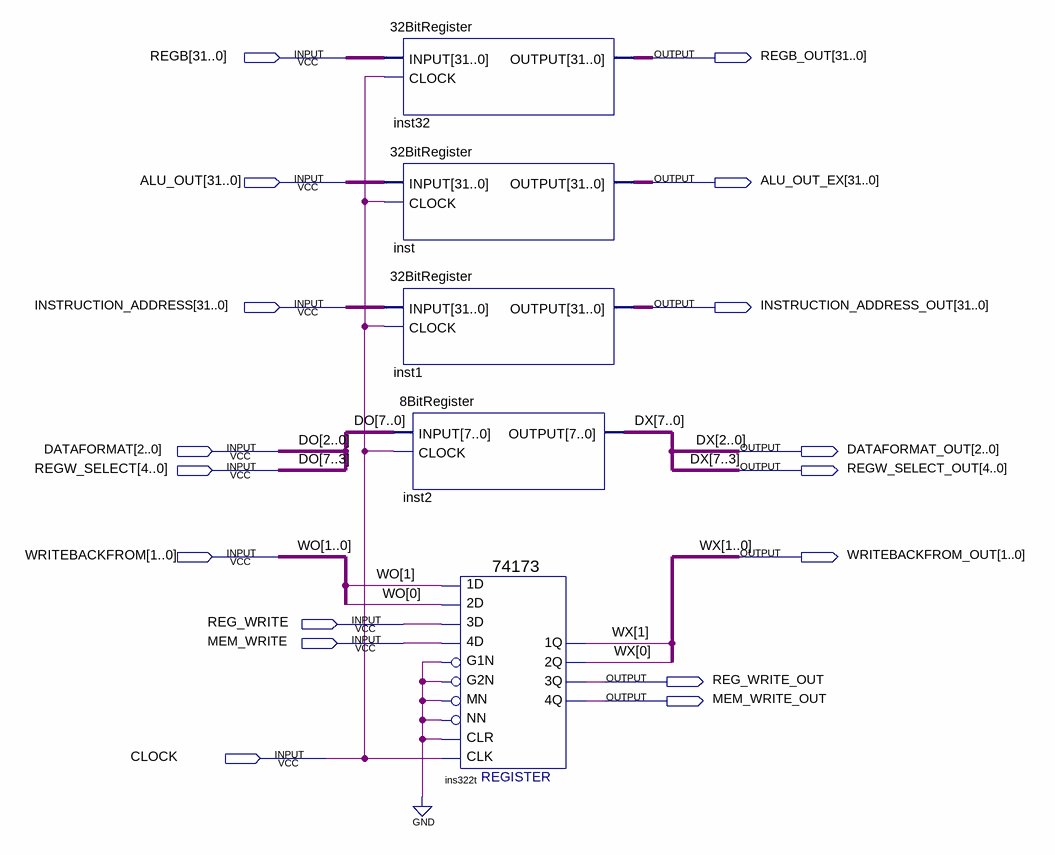
[diagram p0: schematic sheet]
// Quartus schematic EXECUTE_MEMACCESS.bdf as structural Verilog: 5 symbols, 17 pins
module EXECUTE_MEMACCESS (
  input  [31:0] REGB,
  input  [31:0] ALU_OUT,
  input  [31:0] INSTRUCTION_ADDRESS,
  input  [2:0] DATAFORMAT,
  input  [4:0] REGW_SELECT,
  input  [1:0] WRITEBACKFROM,
  input  REG_WRITE,
  input  MEM_WRITE,
  input  CLOCK,
  output [31:0] REGB_OUT,
  output [31:0] ALU_OUT_EX,
  output [31:0] INSTRUCTION_ADDRESS_OUT,
  output [2:0] DATAFORMAT_OUT,
  output [4:0] REGW_SELECT_OUT,
  output [1:0] WRITEBACKFROM_OUT,
  output REG_WRITE_OUT,
  output MEM_WRITE_OUT
);

  \32BitRegister  inst32 (.INPUT(REGB), .CLOCK(CLOCK), .OUTPUT(REGB_OUT));
  \32BitRegister  inst (.INPUT(ALU_OUT), .CLOCK(CLOCK), .OUTPUT(ALU_OUT_EX));
  \32BitRegister  inst1 (.INPUT(INSTRUCTION_ADDRESS), .CLOCK(CLOCK), .OUTPUT(INSTRUCTION_ADDRESS_OUT));
  \8BitRegister  inst2 (.INPUT({REGW_SELECT, DATAFORMAT}), .CLOCK(CLOCK), .OUTPUT({REGW_SELECT_OUT, DATAFORMAT_OUT}));
  \74173  ins322t (
    .\3D (REG_WRITE), .MN(1'b0), .\1D (WRITEBACKFROM[1]), .\2D (WRITEBACKFROM[0]), .\4D (MEM_WRITE),
    .G1N(1'b0), .G2N(1'b0), .NN(1'b0), .CLR(1'b0), .CLK(CLOCK), .\3Q (REG_WRITE_OUT),
    .\2Q (WRITEBACKFROM_OUT[0]), .\1Q (WRITEBACKFROM_OUT[1]), .\4Q (MEM_WRITE_OUT));

  // Other names for the same wires on the sheet: DO[7:0] = {REGW_SELECT, DATAFORMAT};
  //   DX[7:0] = {REGW_SELECT_OUT, DATAFORMAT_OUT}; WO[1:0] = WRITEBACKFROM; WX[1:0] = WRITEBACKFROM_OUT
endmodule
